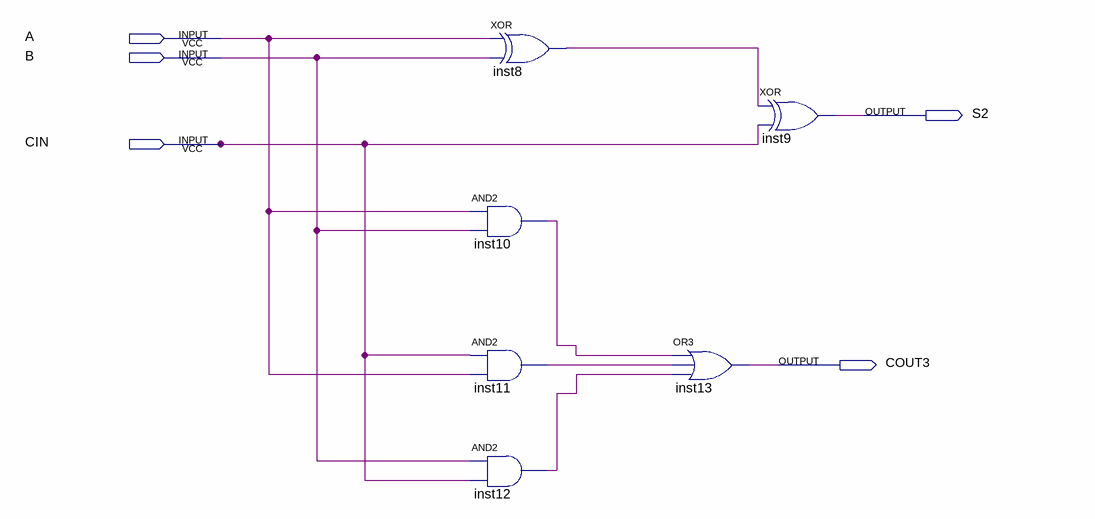
[diagram p0: schematic sheet]
// Quartus schematic FA.bdf as structural Verilog: 6 symbols, 5 pins
module FA (
  input  A,
  input  B,
  input  CIN,
  output S2,
  output COUT3
);

  wire inst8_out, inst10_out, inst11_out, inst12_out;

  and inst10 (inst10_out, A, B);
  and inst11 (inst11_out, CIN, A);
  and inst12 (inst12_out, B, CIN);
  xor inst8 (inst8_out, A, B);
  or inst13 (COUT3, inst10_out, inst11_out, inst12_out);
  xor inst9 (S2, inst8_out, CIN);
endmodule
